# Altium schematic sheet Sheet1.SchDoc
size A
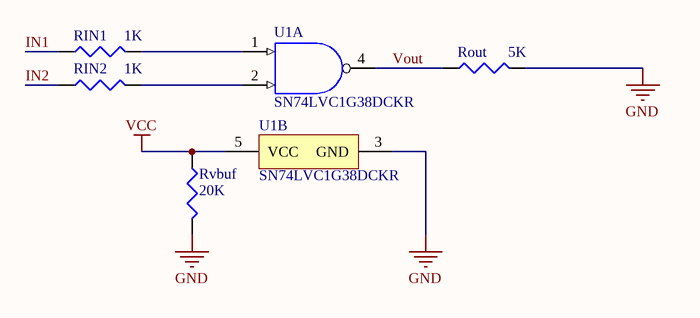
[diagram p0: Sheet1.SchDoc]

## Parts
RIN1  value 1K  [J1-0603]  (hidden comment: Res3)
RIN2  value 1K  [J1-0603]  (hidden comment: Res3)
Rout  value 5K  [J1-0603]  (hidden comment: Res3)
Rvbuf  value 20K  [J1-0603]  (hidden comment: Res3)
U1  SN74LVC1G38DCKR  [DCK0005A_L]  (parts A,B of 2)

## Nets
GND: Rout.2 Rvbuf.2 U1.3(GND)
VCC: Rvbuf.1 U1.5(VCC)
IN1: RIN1.1
IN2: RIN2.1
Vout: Rout.1 U1.4(Y)
NetRIN1_2: RIN1.2 U1.1(A)
NetRIN2_2: RIN2.2 U1.2(B)

## Library data of the parts
RIN1 RIN2 Rout Rvbuf = Res3: Resistor; Published: 8-Jun-2000; LatestRevisionDate: 29-May-2009; LatestRevisionNote: IPC-7351 Footprint Added.; PackageReference: J1-0603; Publisher: Altium Limited; PackageDescription: Chip Resistor
U1 = CMP-0859-00419-2: Single 2-Input NAND Gate with Open Drain Output, DCK0005A, LARGE T&R; Manufacturer: Texas Instruments; tpd @ Nom Voltage(Max)(ns): 10,6,4.5,3.9; Output Drive (IOL/IOH)(Max)(mA): 32/-32; F @ Nom Voltage(Max)(Mhz): 150; Output Type: CMOS; Voltage(Nom)(V): 1.8,2.5,3.3,5; Technology Family: LVC; Schmitt Trigger: No; Logic: True; ICC @ Nom Voltage(Max)(mA): 0.01; Rating: Catalog; VCC(Min)(V): 1.65; Input Type: CMOS/TTL; Bits(#): 1; VCC(Max)(V): 5.5; ComponentLink1Description: Manufacturer URL; DatasheetVersion: SCES538D; Gate Type: NAND; Operating Temperature Range(C): -40 to 125,-40 to 85; Generic Part Number: SN74LVC1G38; ComponentLink2URL: http://www.ti.com/lit/ds/symlink/sn74lvc1g38.pdf; ComponentLink2Description: Datasheet; ComponentLink1URL: http://www.ti.com/; PartNumber: SN74LVC1G38DCKR; Sub-Family: NAND Gate; 3-State Output: No; PackageReference: DCK0005A